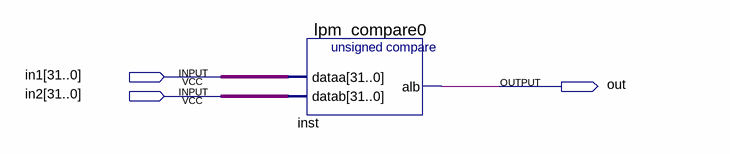
[diagram p0: schematic sheet]
// Quartus schematic slt.bdf as structural Verilog: 1 symbols, 3 pins
module slt (
  input  [31:0] in1,
  input  [31:0] in2,
  output out
);

  lpm_compare0 inst (.dataa(in1), .datab(in2), .alb(out));
endmodule
